# EasyEDA Pro project 平衡车.eprj

# Schematic STM32平衡车
Board Name: STM32平衡车; Create Date: 2024-11-28; Page Name: Sheet_1; Project Name: 平衡车; Schematic Name: STM32平衡车; Update Date: 2025-01-06; Add into BOM: yes; Company: Your Company; Convert to PCB: yes; Date: 2021-10-18; Draw By: 张建宝; REV: 1.0; Sheet: 1/1
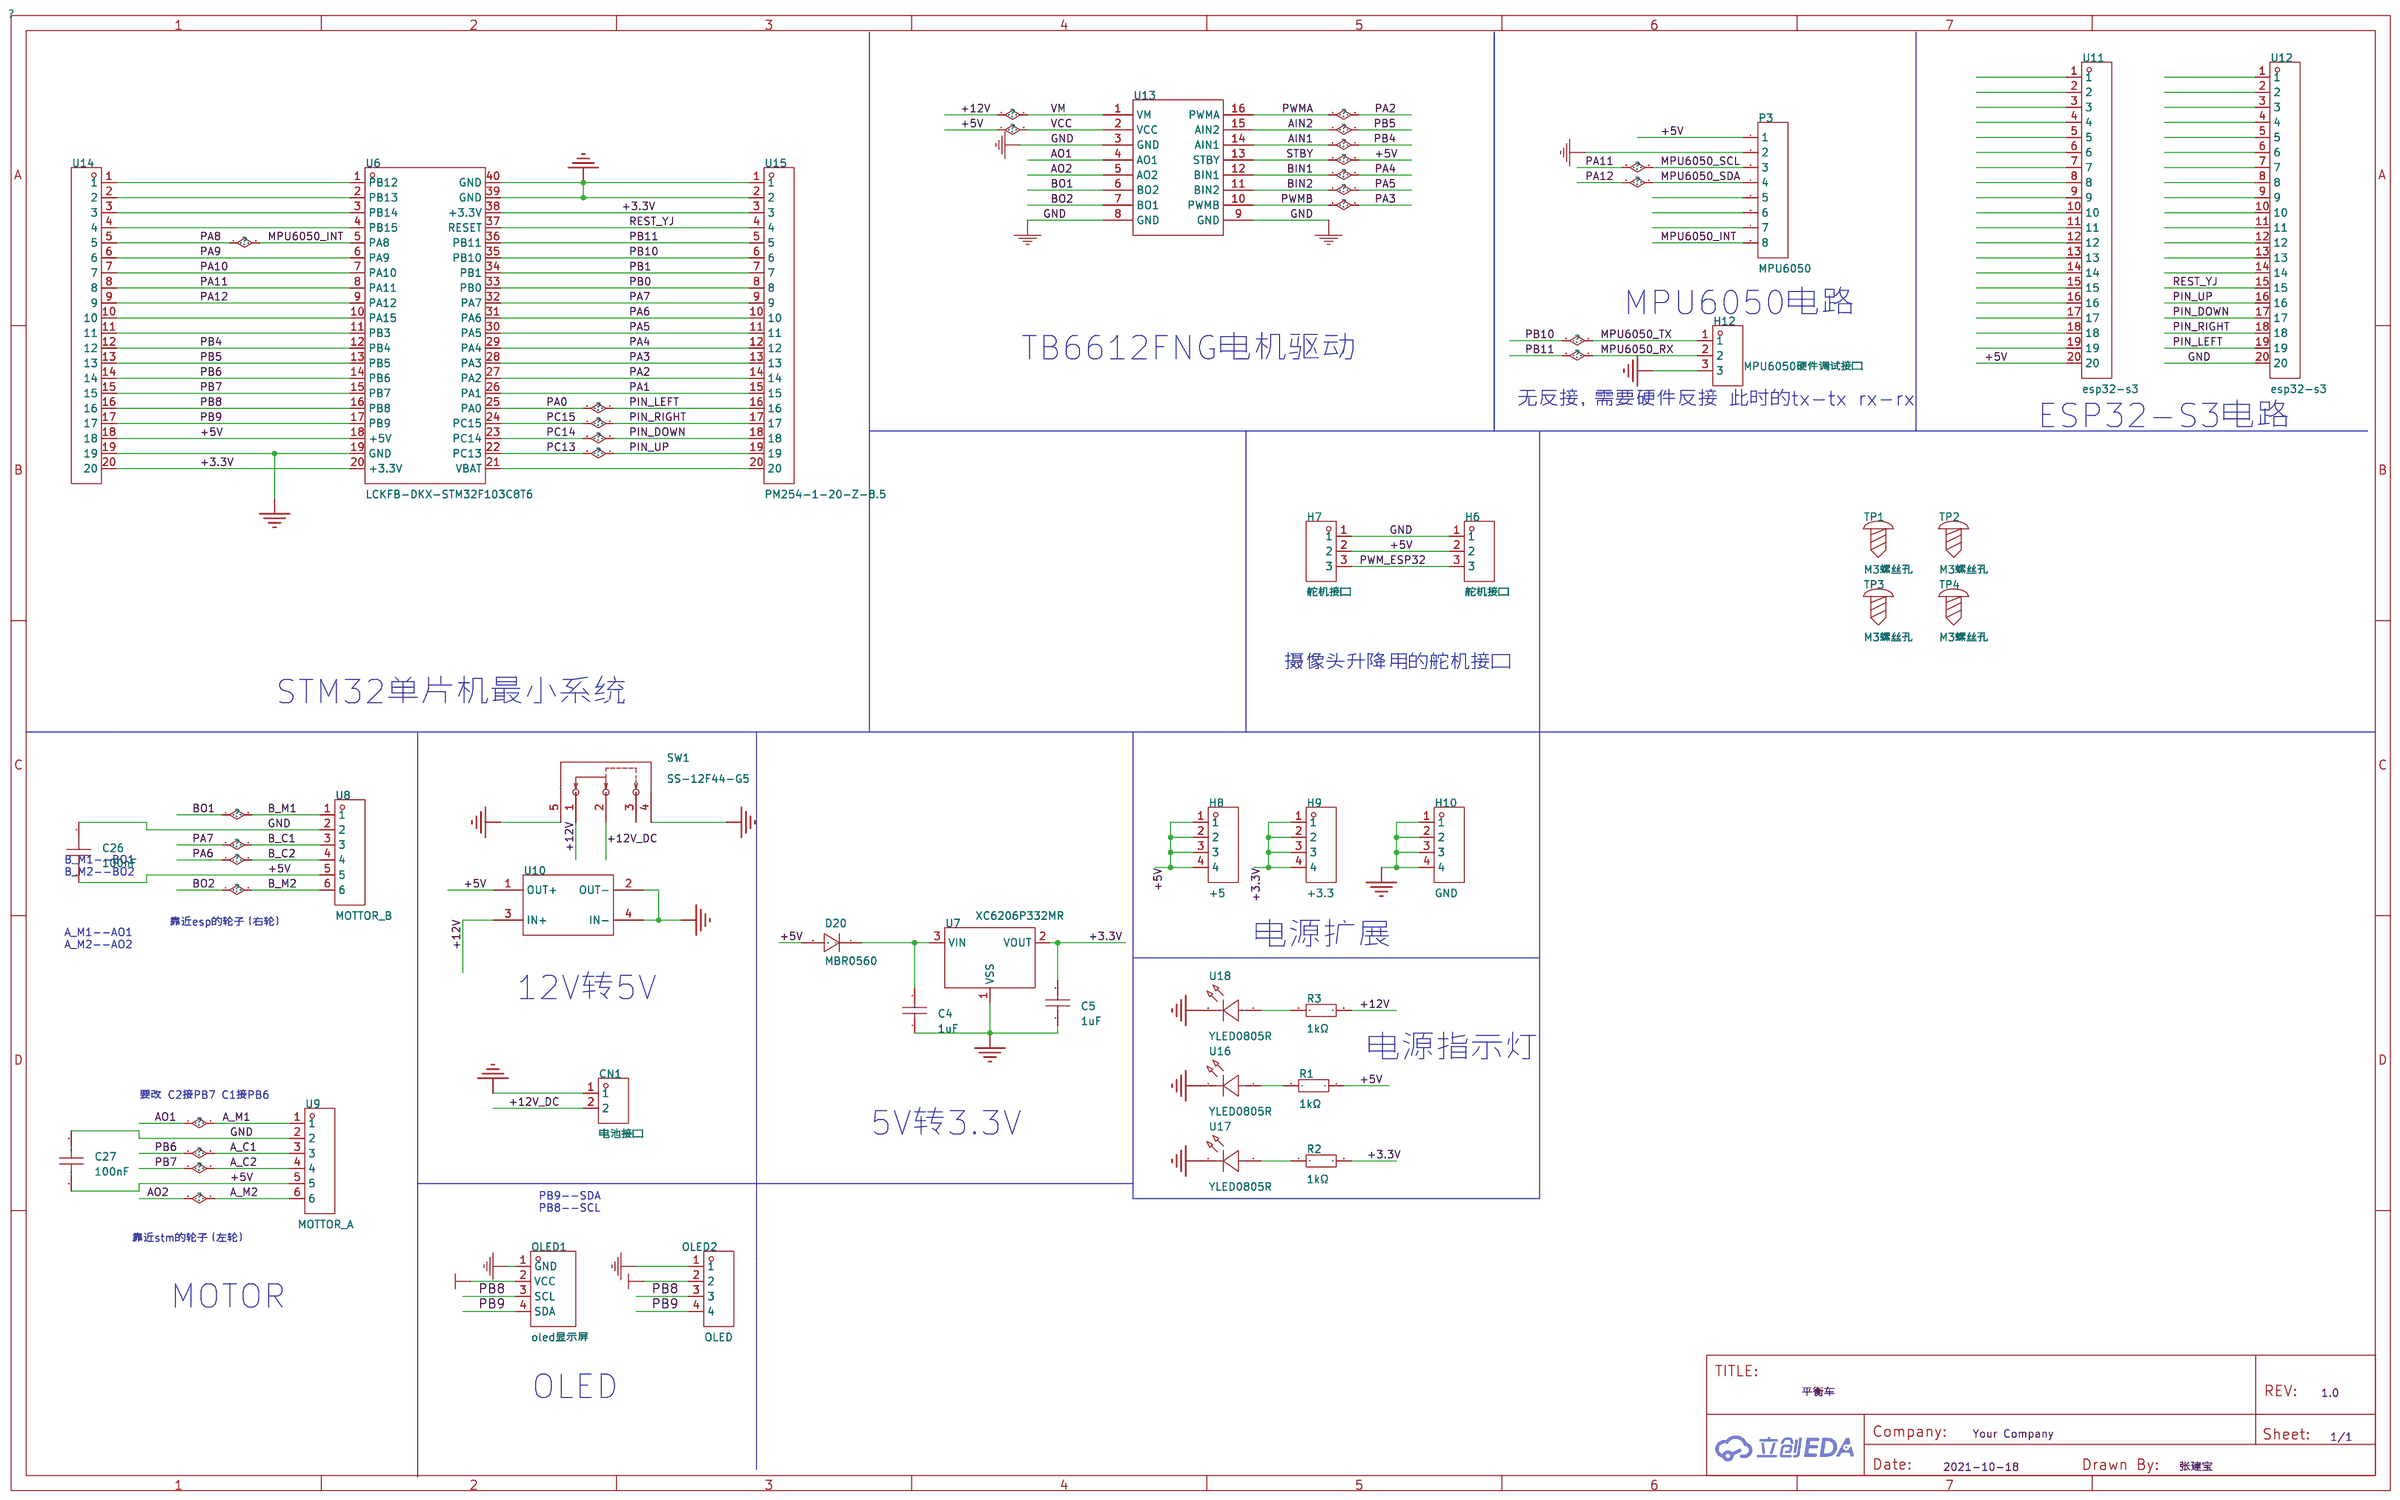
[diagram p0: schematic sheet]

## Parts
C4  1uF  [C0805]
C5  1uF  [C0805]
C26  100nF  [C0805]
C27  100nF  [C0805]
CN1  电池接口  [CONN-TH_2P-P2.50_HX25003-2A]
D20  MBR0560  [SOD-123_L2.8-W1.8-LS3.7-RD]
H6  舵机接口  [HDR-TH_3P-P2.54-V-M]
H7  舵机接口  [HDR-TH_3P-P2.54-V-M]
H8  +5  [HDR-TH_4P-P2.54-V-M]
H9  +3.3  [HDR-TH_4P-P2.54-V-M]
H10  GND  [HDR-TH_4P-P2.54-V-M]
H12  MPU6050硬件调试接口  [HDR-TH_3P-P2.54-V-M]
OLED1  oled显示屏  [OLED-TH_L35.4-W33.5_HS13L03W2C01]
OLED2  OLED  [HDR-TH_4P-P2.54-V-M]
P3  MPU6050  [HDR-TH_8P-P2.54-V-F-1]
R1  1kΩ  [R0805]
R2  1kΩ  [R0805]
R3  1kΩ  [R0805]
SW1  SS-12F44-G5  [SW-TH_SS-12F44-G5]
TP1  M3螺丝孔  [M3螺丝]
TP2  M3螺丝孔  [M3螺丝]
TP3  M3螺丝孔  [M3螺丝]
TP4  M3螺丝孔  [M3螺丝]
U6  LCKFB-DKX-STM32F103C8T6  [CONN-TH_L53.3-W22.9_STM32F103C8T6-CARD]
U7  XC6206P332MR  [SOT-23-3_L2.9-W1.3-P1.90-LS2.4-BR]
U8  MOTTOR_B  [CONN-TH_6P-P2.50_ZX-XH2.54-6PZZ]
U9  MOTTOR_A  [CONN-TH_6P-P2.50_ZX-XH2.54-6PZZ]
U10  -  [DC-DC]
U11  esp32-s3  [HDR-TH_20P-P2.54-V-F-2]
U12  esp32-s3  [HDR-TH_20P-P2.54-V-F-2]
U13  -  [TB6612FNG模块]
U14  PM254-1-20-Z-8.5  [HDR-TH_20P-P2.54-V-F-2]
U15  PM254-1-20-Z-8.5  [HDR-TH_20P-P2.54-V-F-2]
U16  YLED0805R  [LED0805-RD]
U17  YLED0805R  [LED0805-RD]
U18  YLED0805R  [LED0805-RD]

## Library data of the parts
C4 C5 = CL21B105KBFNNNE: 容值:1uF;精度:±10%;额定电压:50V;材质(温度系数):X7R;; LCSC Part Name: 1uF ±10% 50V; Supplier Part: C28323; Manufacturer: SAMSUNG(三星); Supplier Footprint: 0805; JLCPCB Part Class: 基础库; Datasheet: https://atta.szlcsc.com/upload/public/pdf/source/20160103/1457707718219.pdf; Supplier: LCSC; Tolerance: ±10%; Voltage Rated: 50V; Temperature Coefficient: X7R
C26 C27 = CC0805KRX7R9BB104: LCSC Part Name: 100nF ±10% 50V; Supplier Part: C49678; Manufacturer: YAGEO(国巨); Supplier Footprint: 0805; JLCPCB Part Class: 基础库; Datasheet: https://atta.szlcsc.com/upload/public/pdf/source/20180224/C181747_15194369449651363981.pdf; Supplier: LCSC; Tolerance: ±10%; Voltage Rated: 50V; Temperature Coefficient: X7R
CN1 = ZX-XH2.54-2PZZ: Supplier Part: C7429632; Manufacturer: Megastar(兆星); Supplier Footprint: 插件,P=2.54mm; JLCPCB Part Class: 扩展库; Datasheet: https://atta.szlcsc.com/upload/public/pdf/source/20230619/19BA6947230AA44A04D3EDD65E618FD0.pdf; Supplier: LCSC; Pins Structure: 1x2P; Pitch: 2.54mm; Mounting Style: 直插; Reference Series: XH; Number of Pins: 2P; Number of Rows: 1; Number of PINs Per Row: 2; Current Rating (Max): 3A; Contact Material: 黄铜; Contact Plating: 锡; Operating Temperature Range: -25℃~+85℃
D20 = MBR0560: 直流反向耐压(Vr):60V;平均整流电流(Io):500mA;正向压降(Vf):700mV@500mA;; LCSC Part Name: 60V 500mA 700mV@500mA; Supplier Part: C77338; Manufacturer: CJ(江苏长电/长晶); Supplier Footprint: SOD-123; JLCPCB Part Class: 扩展库; Datasheet: https://atta.szlcsc.com/upload/public/pdf/source/20160702/1467448303403.pdf; Supplier: LCSC; Reverse Voltage (Vr): 60V; Average Rectified Current (Io): 500mA; Forward Voltage (Vf@If): 700mV@500mA
H6 H7 H12 = PZ254V-11-03P: LCSC Part Name: 间距:2.54mm 1x3P 直插 方针; Supplier Part: C2937625; Manufacturer: XFCN(兴飞); Supplier Footprint: 插件,P=2.54mm; JLCPCB Part Class: 扩展库; Datasheet: https://atta.szlcsc.com/upload/public/pdf/source/20200309/C492402_8335C3D49C4E4C618838D59BB1D024C1.pdf; Supplier: LCSC; Pin Structure: 1x3P; Pitch: 2.54mm; Circluar Pins/Square Pins: 方针; Mounting Type: 直插; Number of Rows: 单排; Number of Pins: 3P; Current Rating (Max): 3A; Voltage Rating (Max): 250V; Length of Mating Pin: 6mm; Insulation Height: 2.5mm; Length of End Connection Pin: 3mm; Operating Temperature Range: -40℃~+105℃; Color: 黑色
H8-H10 OLED2 = PZ254V-11-04P: LCSC Part Name: 间距:2.54mm 1x4P 直插 方针; Supplier Part: C2691448; Manufacturer: XFCN(兴飞); Supplier Footprint: 插件,P=2.54mm; JLCPCB Part Class: 扩展库; Datasheet: https://atta.szlcsc.com/upload/public/pdf/source/20200309/C492403_F9F19131791D08044AD4F84F8E751A34.pdf; Supplier: LCSC; Pin Structure: 1x4P; Pitch: 2.54mm; Circluar Pins/Square Pins: 方针; Mounting Type: 直插; Number of Rows: 单排; Number of Pins: 4P; Current Rating (Max): 3A; Voltage Rating (Max): 250V; Length of Mating Pin: 6mm; Insulation Height: 2.5mm; Length of End Connection Pin: 3mm; Operating Temperature Range: -40℃~+105℃; Color: 黑色
OLED1 = HS13L03W2C01: LCSC Part Name: 1.3'1.3寸 128*64 OLED显示屏 I2C通讯 SH1106 白光; Supplier Part: C7465997; Manufacturer: HS(汉昇); JLCPCB Part Class: 扩展库; Datasheet: https://atta.szlcsc.com/upload/public/pdf/source/20230720/8731A47396DED074CDCD72E9ACEFB46F.pdf; Supplier: LCSC; Main Control Chip: SH1106; Interface Type: I2C; Size: 1.3; Operating Temperature: -40℃~+70℃
P3 = 2.54-1*8P母环保: LCSC Part Name: 间距:2.54mm 1x8P 直插; Supplier Part: C27438; Manufacturer: BOOMELE(博穆精密); Supplier Footprint: 插件,P=2.54mm; JLCPCB Part Class: 扩展库; Datasheet: https://atta.szlcsc.com/upload/public/pdf/source/20231221/1CA800C6799ED97958773716FAA1BFFE.pdf; Supplier: LCSC; Holes Structure: 1x8P; Pitch: 2.54mm; Mounting Type: 直插; Number of Rows: 单排; Number of Holes: 8P
R1-R3 = 0805W8F1002T5E_C17414: LCSC Part Name: 10kΩ ±1% 125mW 厚膜电阻; Supplier Part: C17414; Manufacturer: UNI-ROYAL(厚声); Manufacturer Part: 0805W8F1002T5E; Supplier Footprint: 0805; JLCPCB Part Class: 基础库; Datasheet: https://atta.szlcsc.com/upload/public/pdf/source/20200306/C422600_1E6D84923E4A46A82E41ADD87F860B5C.pdf; Supplier: LCSC; Type: 厚膜电阻; Tolerance: ±1%; Power(Watts): 125mW; Overload Voltage (Max): 150V; Temperature Coefficient: ±100ppm/℃; Operating Temperature Range: -55℃~+155℃
SW1 = SS-12F44-G5_C136718: LCSC Part Name: 直插双档 滑动开关; Supplier Part: C136718; Manufacturer: 韩国韩荣; Supplier Footprint: 插件; JLCPCB Part Class: 扩展库; Datasheet: https://atta.szlcsc.com/upload/public/pdf/source/20171123/C136718_15114108132111137440.pdf; Supplier: LCSC; Circuit: 单刀双掷; Actuator Style: 矩形柱状; Pin Style: PC引脚; Switch Height: 11mm; Mounting Style: 直插; Mechanical Life: 5千次; Operating Temperature: -25℃~+70℃
TP1-TP4 = M3螺丝孔
U6 = LCKFB-DKX-STM32F103C8T6: LCSC Part Name: 立创·地阔星-STM32F103C8T6开发板; Supplier Part: C22396880; Manufacturer: 立创开发板; JLCPCB Part Class: 扩展库; Datasheet: https://atta.szlcsc.com/upload/public/pdf/source/20240801/7EEF69F7480DF7C6DA98696664D658D4.pdf; Supplier: LCSC
U7 = XC6206P332MR_C5148692: 输出类型:固定;输出极性:正;最大输入电压:8V;输出电压:3.3V;输出电流:300mA;; LCSC Part Name: 输入8V 输出3.3V 300mA; Supplier Part: C5148692; Manufacturer: HXY MOSFET(华轩阳电子); Supplier Footprint: SOT-23(TO-236); JLCPCB Part Class: 扩展库; Datasheet: https://atta.szlcsc.com/upload/public/pdf/source/20230315/7D5B35EFFBBF81C2EFC36318D2A1A670.pdf; Supplier: LCSC; Output Type: 固定; Output Polarity: 正; Number of Outputs: 1; Maximum Input Voltage: 8V; Output Voltage: 3.3V; Dropout Voltage: 240mV@(50mA); Output Current: 300mA
U8 U9 = ZX-XH2.54-6PZZ: LCSC Part Name: 配套胶壳型号：ZX-XH2.54-6PJK 配套端子型号：ZX-XH2.54-DZ 配套杜邦线型号：ZX-XH2.54-6PBXC; Supplier Part: C7429636; Manufacturer: Megastar(兆星); Supplier Footprint: 插件,P=2.54mm; JLCPCB Part Class: 扩展库; Datasheet: https://atta.szlcsc.com/upload/public/pdf/source/20230619/1243AD0A516E39CD3D274D8985780568.pdf; Supplier: LCSC; Pins Structure: 1x6P; Pitch: 2.54mm; Mounting Style: 直插; Reference Series: XH; Number of Pins: 6P; Number of Rows: 1; Number of PINs Per Row: 6; Current Rating (Max): 3A; Contact Material: 黄铜; Contact Plating: 锡; Operating Temperature Range: -25℃~+85℃
U10 = dc-dc升压模块
U11 U12 U14 U15 = PM254-1-20-Z-8.5: LCSC Part Name: 1x20P 间距:2.54mm 直插; Supplier Part: C2897383; Manufacturer: HCTL(华灿天禄); Supplier Footprint: 插件,P=2.54mm; JLCPCB Part Class: 扩展库; Datasheet: https://atta.szlcsc.com/upload/public/pdf/source/20230609/534BE42964C679BDE98E061007C4ABD6.pdf; Supplier: LCSC; Holes Structure: 1x20P; Pitch: 2.54mm; Circular Hole / Square Hole: 方孔; Mounting Type: 直插; Number of Rows: 单排; Number of Holes: 20P; Current Rating (Max): 3A; Holes Direction: 顶部; Insulation Height: 8.5mm; Contact Material: 铜合金; Operating Temperature Range: -40℃~+105℃; Soldering Temperature(Max): 260℃@5S
U13 = TB6612FNG模块
U16-U18 = YLED0805R: Supplier Part: C19171391; Manufacturer: YONGYUTAI(永裕泰); Supplier Footprint: 0805; JLCPCB Part Class: 扩展库; Datasheet: https://atta.szlcsc.com/upload/public/pdf/source/20231027/AB486D22E6D71BC59190C48A798367E6.pdf; Supplier: LCSC; Emitted Color: 红色; Forward Voltage (VF): 1.8V~2.4V; Power Dissipation: 60mW; Forward Current: 20mA; Dominant Wavelength: 615nm~630nm; Peak Wavelength: 645nm; Operating Temperature: -40℃~+85℃

## Nets
+3.3V: C5.2 H9.1 H9.2 H9.3 H9.4 R2.2 U6.20(+3.3V) U6.38(+3.3V) U7.2(VOUT) U14.20 U15.3
+5V: C26.1 C27.1 D20.2 H6.2 H7.2 H8.1 H8.2 H8.3 H8.4 OLED1.2(VCC) OLED2.2 P3.1 R1.2 U6.18(+5V) U8.5 U9.5 U10.1(OUT+) U11.20 U13.2(VCC) U13.13(STBY) U14.18
+12V: R3.2 SW1.1 U10.3(IN+) U13.1(VM)
+12V_DC: CN1.2 SW1.2
GND: C4.1 C5.1 C26.2 C27.2 CN1.1 H6.1 H7.1 H10.1 H10.2 H10.3 H10.4 H12.3 OLED1.1(GND) OLED2.1 P3.2 SW1.4 SW1.5 U6.19(GND) U6.39(GND) U6.40(GND) U7.1(VSS) U8.2 U9.2 U10.2(OUT-) U10.4(IN-) U12.20 U13.3(GND) U13.8(GND) U13.9(GND) U14.19 U15.1 U15.2 U16.1(K) U17.1(K) U18.1(K)
A_C1: U6.14(PB6) U9.3 U14.14
A_C2: U6.15(PB7) U9.4 U14.15
AIN1: U6.12(PB4) U13.14(AIN1) U14.12
AIN2: U6.13(PB5) U13.15(AIN2) U14.13
AO1: U9.1 U13.4(AO1)
AO2: U9.6 U13.5(AO2)
B_C1: U6.32(PA7) U8.3 U15.9
B_C2: U6.31(PA6) U8.4 U15.10
BIN1: U6.29(PA4) U13.12(BIN1) U15.12
BIN2: U6.30(PA5) U13.11(BIN2) U15.11
BO1: U8.1 U13.6(BO2)
BO2: U8.6 U13.7(BO1)
MPU6050_INT: P3.8 U6.5(PA8) U14.5
MPU6050_RX: H12.2 U6.36(PB11) U15.5
MPU6050_SCL: P3.3 U6.8(PA11) U14.8
MPU6050_SDA: P3.4 U6.9(PA12) U14.9
MPU6050_TX: H12.1 U6.35(PB10) U15.6
PA0: U6.25(PA0) U12.19 U15.16
PA1: U6.26(PA1) U15.15
PA2: U6.27(PA2) U13.16(PWMA) U15.14
PA3: U6.28(PA3) U13.10(PWMB) U15.13
PA9: U6.6(PA9) U14.6
PA10: U6.7(PA10) U14.7
PB0: U6.33(PB0) U15.8
PB1: U6.34(PB1) U15.7
PB8: OLED1.3(SCL) OLED2.3 U6.16(PB8) U14.16
PB9: OLED1.4(SDA) OLED2.4 U6.17(PB9) U14.17
PC13: U6.22(PC13) U12.16 U15.19
PC14: U6.23(PC14) U12.17 U15.18
PC15: U6.24(PC15) U12.18 U15.17
PWM_ESP32: H6.3 H7.3
REST_YJ: U6.37(RESET) U12.15 U15.4
$1N4351: C4.2 D20.1 U7.3(VIN)
$1N5150: U6.1(PB12) U14.1
$1N5156: U6.2(PB13) U14.2
$1N5158: U6.3(PB14) U14.3
$1N5160: U6.4(PB15) U14.4
$1N5210: U6.11(PB3) U14.11
$1N5216: U6.10(PA15) U14.10
$1N5238: U6.21(VBAT) U15.20
$1N12997: R1.1 U16.2(A)
$1N12999: R2.1 U17.2(A)
$1N13001: R3.1 U18.2(A)

Not connected (* = marked no-connect by the designer): P3 5 6 7; SW1 3; U11 1 2 3 4 5 6 7 8 9 10 11 12 13 14 15 16 17 18 19; U12 1 2 3 4 5 6 7 8 9 10 11 12 13 14

## Notes on the sheet
- MPU6050电路
- TB6612FNG电机驱动
- 无反接，需要硬件反接 此时的tx-tx rx-rx
- ESP32-S3电路
- 摄像头升降用的舵机接口
- STM32单片机最小系统
- 靠近esp的轮子（右轮）
- B_M1--BO1
  B_M2--BO2
  A_M1--AO1
  A_M2--AO2
- 电源扩展
- 12V转5V
- 电源指示灯
- 要改 C2接PB7 C1接PB6
- 5V转3.3V
- PB9--SDA
  PB8--SCL
- 靠近stm的轮子（左轮）
- MOTOR
- OLED

# Board PCB1
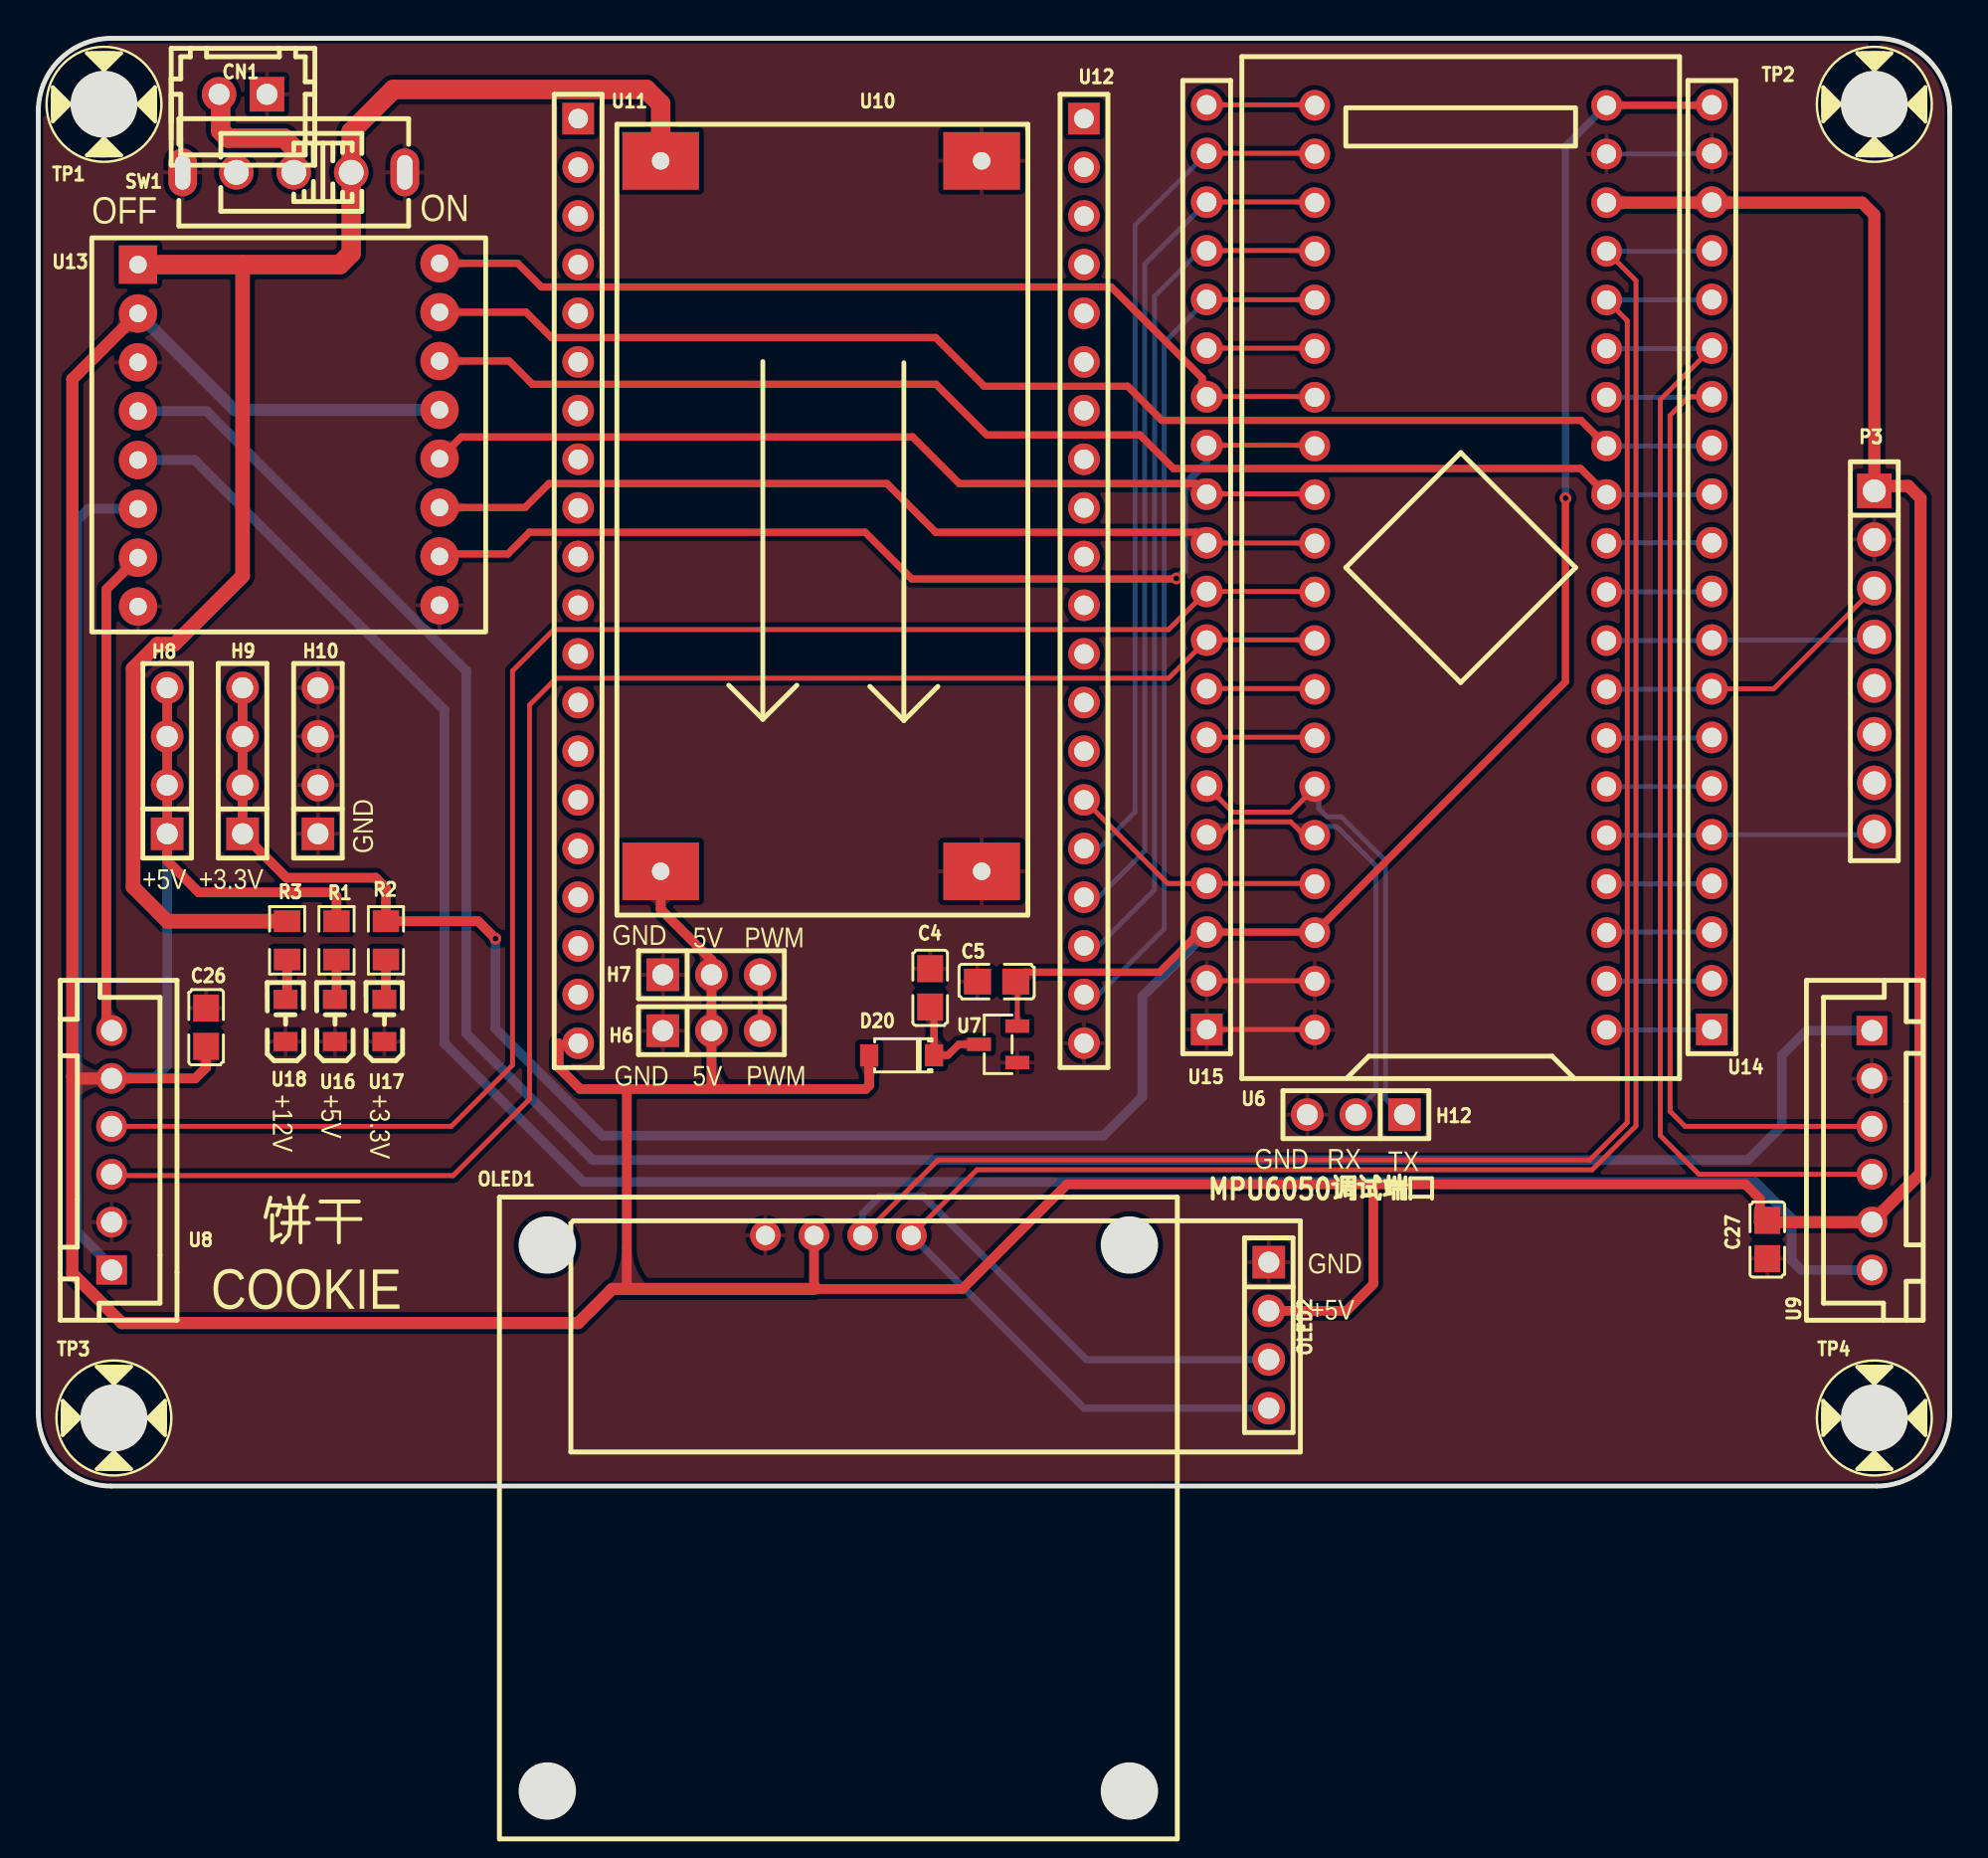
[diagram p1: board, top side]
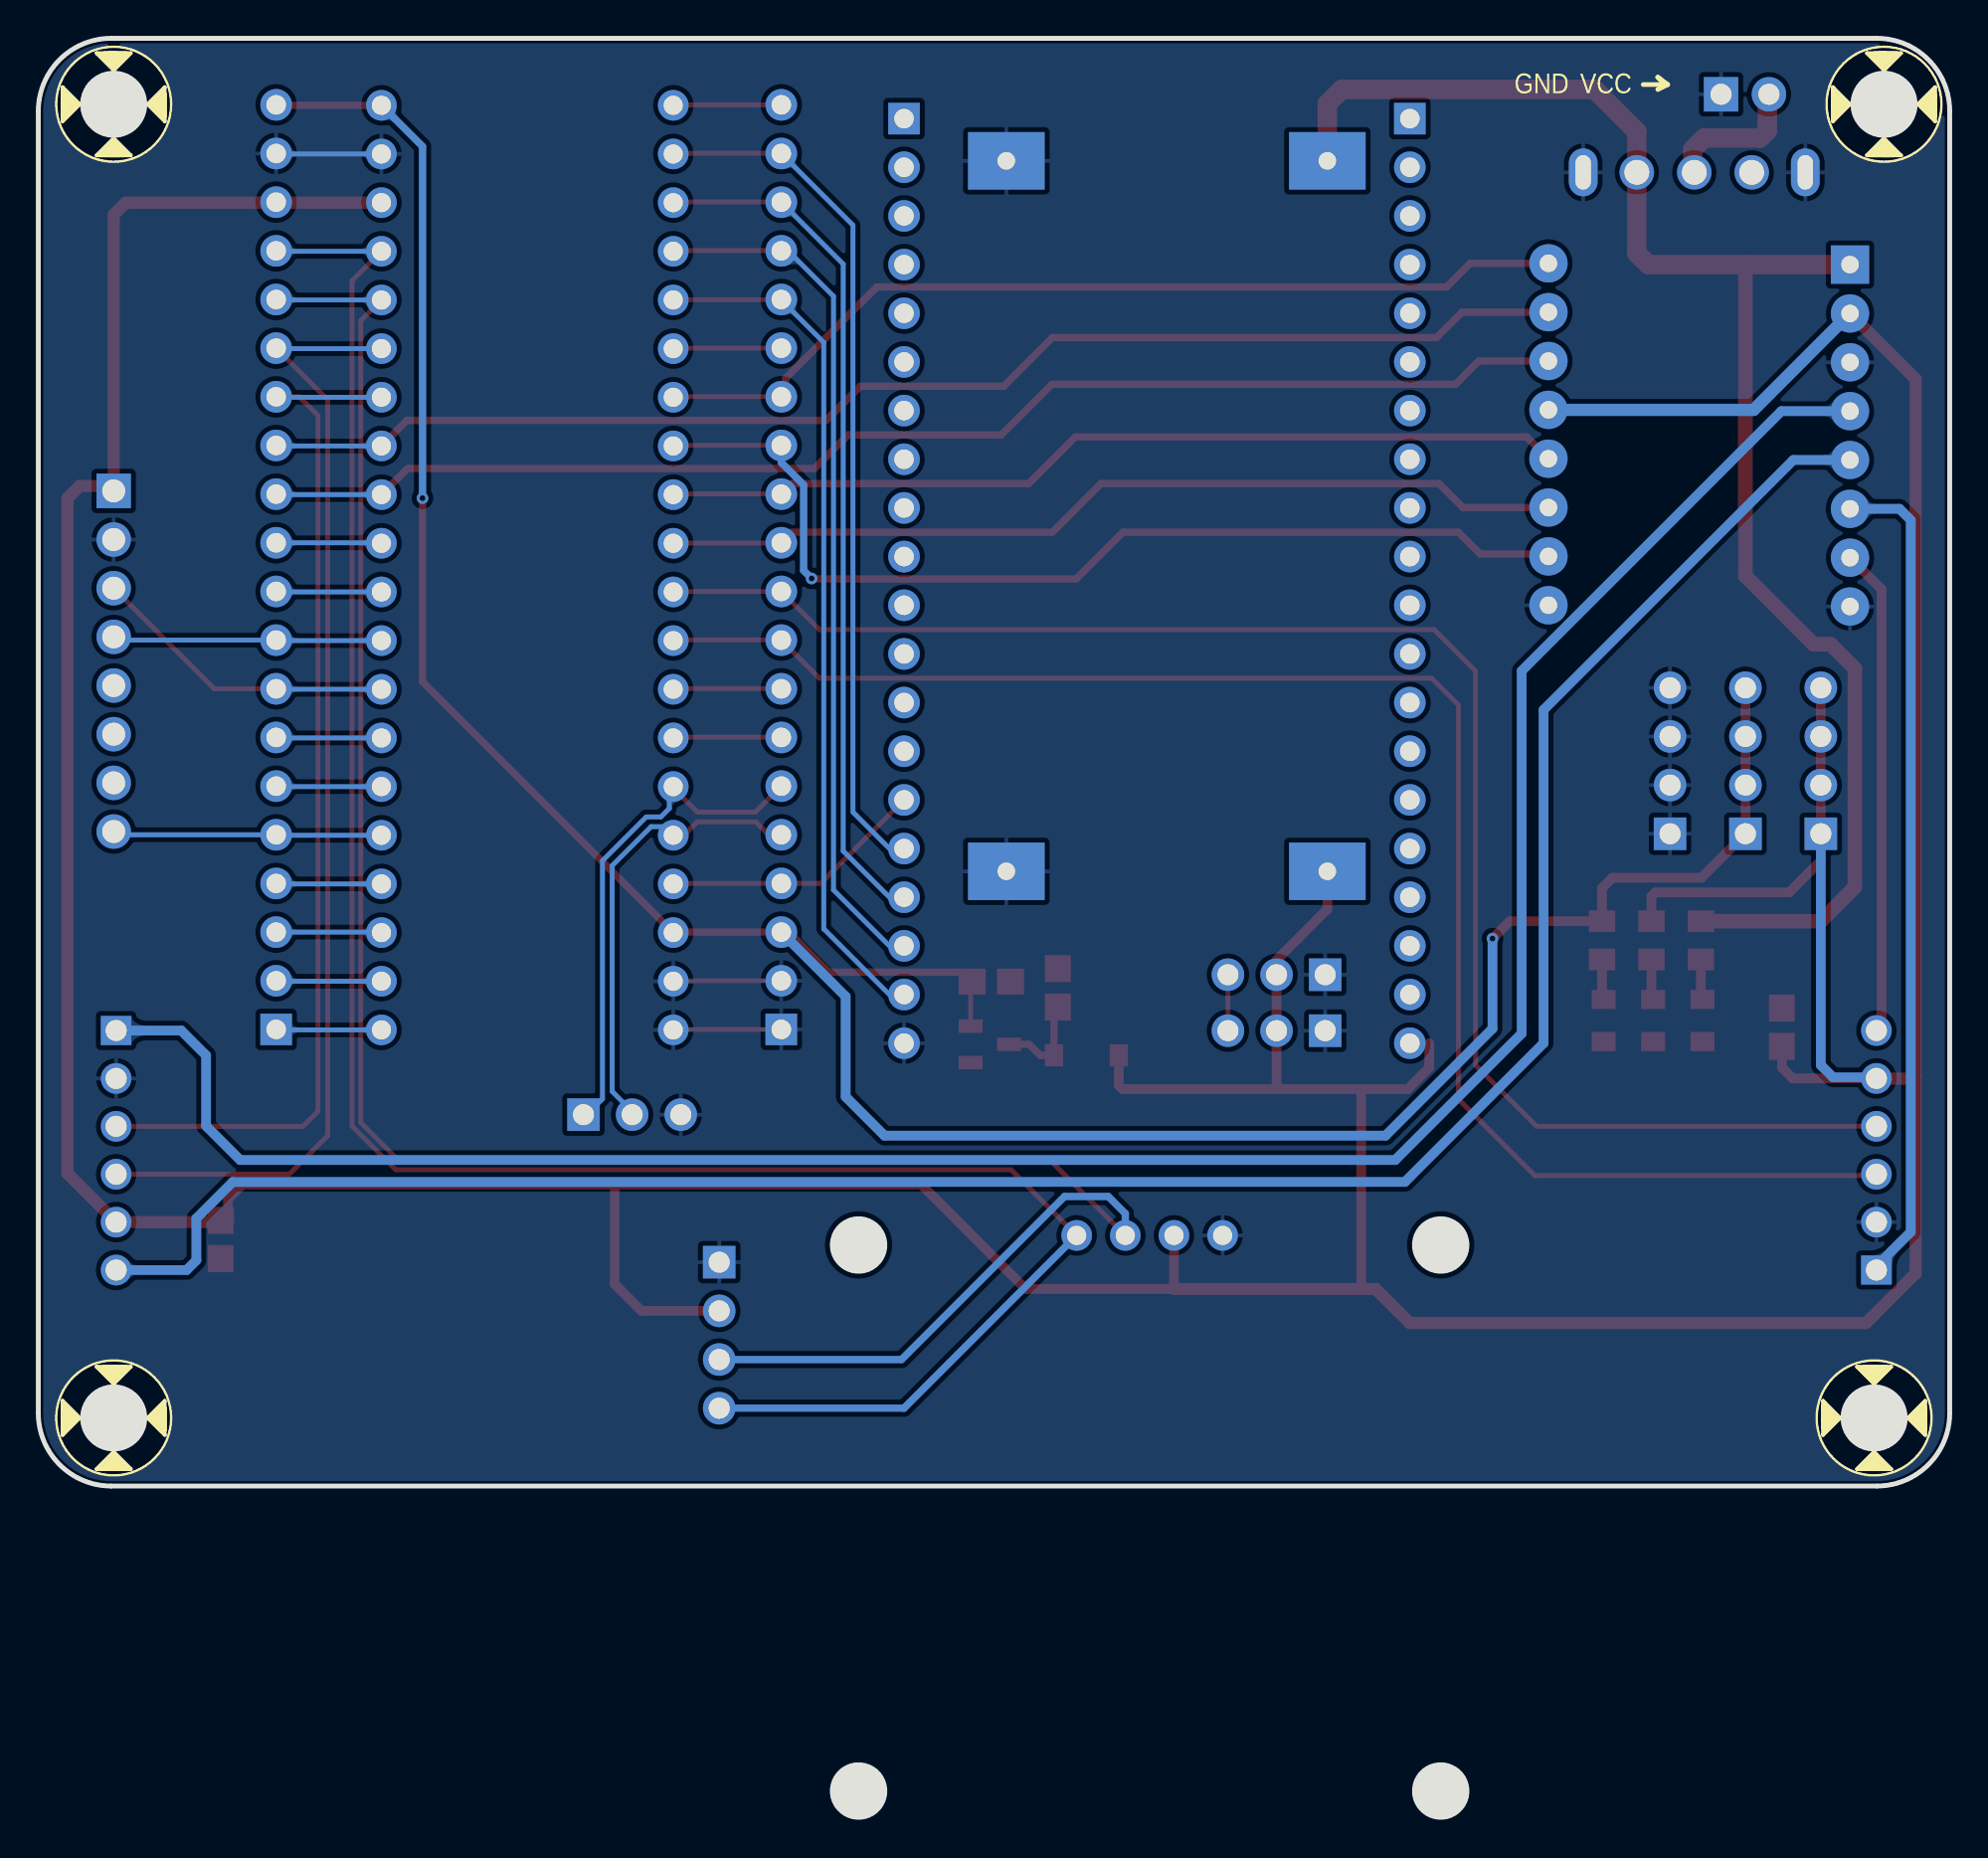
[diagram p2: board, bottom side, seen from below]

Outline 99.82 x 92.98 mm; copper layers: Top Layer, Bottom Layer. Coordinates in mm from the lower left corner of the outline.
Outline path: 0,89.17 0,21.22 arc(1.12,18.53) 3.81,17.41 96.01,17.41 arc(98.71,18.53) 99.82,21.22 99.82,89.17 arc(98.71,91.86) 96.01,92.98 3.81,92.98 arc(1.12,91.86) 0,89.17
Stack: Top Layer 0.035mm / Dielectric1 1.51mm FR4 er 4.5 / Bottom Layer 0.035mm

## Design rules (mm)
template: JLCPCB Capability(Two Layers Board)
spacing copperThickness1oz (default): track to track 0.102, other pairs 0.152 to 0.3
spacing copperThickness2oz: track to track 0.203, other pairs 0.152 to 0.3
track width copperThickness1oz (default): min 0.127, default 0.254, max 2.54
track width copperThickness2oz: min 0.203, default 0.254, max 2.54
differential pair differentialPair (default): width min 0.127, default 0.254, max 2.54; gap min 0.152, default 0.152
via viaSize (default): diameter min 0.5, default 0.61, max 10; hole min 0.3, default 0.305, max 6.3

## Placement (name value [footprint] x y rotation side)
C4  1uF  [C0805]  46.58 43.42 270 top
C5  1uF  [C0805]  50.05 43.74 0 top
C26  100nF  [C0805]  8.76 41.36 90 top
C27  100nF  [C0805]  90.3 30.28 270 top
CN1  电池接口  [CONN-TH_2P-P2.50_HX25003-2A]  10.69 90.06 0 top
D20  MBR0560  [SOD-123_L2.8-W1.8-LS3.7-RD]  45.08 39.9 180 top
H6  舵机接口  [HDR-TH_3P-P2.54-V-M]  35.15 41.18 0 top
H7  舵机接口  [HDR-TH_3P-P2.54-V-M]  35.15 44.1 0 top
H8  +5  [HDR-TH_4P-P2.54-V-M]  6.73 55.27 90 top
H9  +3.3  [HDR-TH_4P-P2.54-V-M]  10.67 55.27 90 top
H10  GND  [HDR-TH_4P-P2.54-V-M]  14.61 55.27 90 top
H12  MPU6050硬件调试接口  [HDR-TH_3P-P2.54-V-M]  68.81 36.8 180 top
OLED1  oled显示屏  [OLED-TH_L35.4-W33.5_HS13L03W2C01]  41.78 30.5 0 top
OLED2  OLED  [HDR-TH_4P-P2.54-V-M]  64.26 25.29 270 top
P3  MPU6050  [HDR-TH_8P-P2.54-V-F-1]  95.89 60.47 270 top
R1  1kΩ  [R0805]  15.58 45.9 90 top
R2  1kΩ  [R0805]  18.16 45.9 90 top
R3  1kΩ  [R0805]  12.99 45.9 90 top
SW1  SS-12F44-G5  [SW-TH_SS-12F44-G5]  13.34 85.98 180 top
TP1  M3螺丝孔  [M3螺丝]  3.43 89.54 0 top
TP2  M3螺丝孔  [M3螺丝]  95.89 89.54 0 top
TP3  M3螺丝孔  [M3螺丝]  3.95 20.97 0 top
TP4  M3螺丝孔  [M3螺丝]  95.89 20.97 0 top
U6  LCKFB-DKX-STM32F103C8T6  [CONN-TH_L53.3-W22.9_STM32F103C8T6-CARD]  74.28 65.35 90 top
U7  XC6206P332MR  [SOT-23-3_L2.9-W1.3-P1.90-LS2.4-BR]  50.13 40.47 0 top
U8  MOTTOR_B  [CONN-TH_6P-P2.50_ZX-XH2.54-6PZZ]  3.83 34.94 270 top
U9  MOTTOR_A  [CONN-TH_6P-P2.50_ZX-XH2.54-6PZZ]  95.76 34.94 90 top
U10  -  [DC-DC]  41.47 67.28 180 top
U11  esp32-s3  [HDR-TH_20P-P2.54-V-F-2]  28.19 64.66 270 top
U12  esp32-s3  [HDR-TH_20P-P2.54-V-F-2]  54.61 64.66 270 top
U13  -  [TB6612FNG模块]  13.08 72.28 0 top
U14  PM254-1-20-Z-8.5  [HDR-TH_20P-P2.54-V-F-2]  87.4 65.38 90 top
U15  PM254-1-20-Z-8.5  [HDR-TH_20P-P2.54-V-F-2]  61.02 65.38 90 top
U16  YLED0805R  [LED0805-RD]  15.49 41.71 90 top
U17  YLED0805R  [LED0805-RD]  18.07 41.71 90 top
U18  YLED0805R  [LED0805-RD]  12.91 41.71 90 top

## Footprints (pads in the part's own frame, mm; a bottom-side part is the same pattern mirrored in y, then rotated)
C0805
  rect 1.41x1.35 smd: 1(-1,0) 2(1,0)
CONN-TH_2P-P2.50_HX25003-2A
  rect 1.8x1.8 hole 1.1: 1(1.25,0)
  round 1.8 hole 1.1: 2(-1.25,0)
CONN-TH_6P-P2.50_ZX-XH2.54-6PZZ
  rect 1.524x1.6 hole 1.1: 1(6.25,0)
  round 1.6 hole 1.1: 2(3.75,0) 3(1.25,0) 4(-1.25,0) 5(-3.75,0) 6(-6.25,0)
CONN-TH_L53.3-W22.9_STM32F103C8T6-CARD
  round 1.6 hole 1: 1(-24.13,-7.62) 2(-21.59,-7.62) 3(-19.05,-7.62) 4(-16.51,-7.62) 5(-13.97,-7.62) 6(-11.43,-7.62) 7(-8.89,-7.62) 8(-6.35,-7.62) 9(-3.81,-7.62) 10(-1.27,-7.62) 11(1.27,-7.62) 12(3.81,-7.62) 13(6.35,-7.62) 14(8.89,-7.62) 15(11.43,-7.62) 16(13.97,-7.62) 17(16.51,-7.62) 18(19.05,-7.62) 19(21.59,-7.62) 20(24.13,-7.62) 21(24.13,7.62) 22(21.59,7.62) 23(19.05,7.62) 24(16.51,7.62) 25(13.97,7.62) 26(11.43,7.62) 27(8.89,7.62) 28(6.35,7.62) 29(3.81,7.62) 30(1.27,7.62) 31(-1.27,7.62) 32(-3.81,7.62) 33(-6.35,7.62) 34(-8.89,7.62) 35(-11.43,7.62) 36(-13.97,7.62) 37(-16.51,7.62) 38(-19.05,7.62) 39(-21.59,7.62) 40(-24.13,7.62)
DC-DC
  rect 4x3 hole 0.914: 1(8.964,17.782) 2(-7.8,17.782) 3(8.964,-19.302) 4(-7.8,-19.302)
HDR-TH_3P-P2.54-V-M
  rect 1.7x1.7 hole 1.1: 1(-2.54,0)
  round 1.7 hole 1.1: 2(0,0) 3(2.54,0)
HDR-TH_4P-P2.54-V-M
  rect 1.7x1.7 hole 1.1: 1(-3.81,0)
  round 1.7 hole 1.1: 2(-1.27,0) 3(1.27,0) 4(3.81,0)
HDR-TH_8P-P2.54-V-F-1
  rect 1.8x1.8 hole 1.2: 1(-8.89,0)
  round 1.8 hole 1.2: 2(-6.35,0) 3(-3.81,0) 4(-1.27,0) 5(1.27,0) 6(3.81,0) 7(6.35,0) 8(8.89,0)
HDR-TH_20P-P2.54-V-F-2
  rect 1.65x1.65 hole 1.02: 1(-24.13,0)
  round 1.65 hole 1.02: 2(-21.59,0) 3(-19.05,0) 4(-16.51,0) 5(-13.97,0) 6(-11.43,0) 7(-8.89,0) 8(-6.35,0) 9(-3.81,0) 10(-1.27,0) 11(1.27,0) 12(3.81,0) 13(6.35,0) 14(8.89,0) 15(11.43,0) 16(13.97,0) 17(16.51,0) 18(19.05,0) 19(21.59,0) 20(24.13,0)
LED0805-RD
  rect 1x1.25 smd: 1(-1.1,0) 2(1.1,0)
OLED-TH_L35.4-W33.5_HS13L03W2C01
  round 1.6 hole 1: 1(-3.81,0) 2(-1.27,0) 3(1.27,0) 4(3.81,0)
R0805
  rect 1.133x1.377 smd: 1(-1,0) 2(1,0)
SOD-123_L2.8-W1.8-LS3.7-RD
  rect 0.95x1.15 smd: 1(-1.692,0) 2(1.692,0)
SOT-23-3_L2.9-W1.3-P1.90-LS2.4-BR
  rect 1.25x0.7 smd: 1(1,-0.95) 2(1,0.95) 3(-1,0)
SW-TH_SS-12F44-G5
  round 1.8 hole 1.3: 1(-3,0) 2(0,0) 3(3,0)
  oval 1.5x2.5 hole 0.8x1.8: 4(5.8,0) 5(-5.8,0)
TB6612FNG模块
  rect 2x2 hole 0.914: 1(-7.874,8.89)
  round 2 hole 0.914: 2(-7.874,6.34) 3(-7.874,3.791) 4(-7.874,1.242) 5(-7.874,-1.308) 6(-7.874,-3.857) 7(-7.874,-6.407) 8(-7.874,-8.957) 9(7.874,-8.89) 10(7.874,-6.34) 11(7.874,-3.791) 12(7.874,-1.242) 13(7.874,1.308) 14(7.874,3.857) 15(7.874,6.407) 16(7.874,8.957)

## Nets
As in the schematic.

Pads without a net: SW1 3

## Via types
v1: diameter 0.61, hole 0.305, Top Layer to Bottom Layer, 3 vias

## Routing (per net, layer and track width the routed paths; a pad name or vN(x,y) marks a point on that pad's centre or on a via; arc(x,y) is an arc through that point)
+3.3V: length 149.8
  Top Layer w0.254: U7.2 51.13,43.66 C5.2
  Top Layer w0.381: U14.20 87.37,89.48 U6.20 ; C5.2 51.54,44.24 58.55,44.24 60.64,46.33 66.64,46.33 U6.38 79.76,59.4 v1(79.76,68.98)
  Top Layer w0.508: H9.4 H9.3 H9.2 H9.1 12.96,49.16 17.61,49.16 18.16,48.62 R2.2 22.97,46.9 v1(23.88,45.99)
  Bottom Layer w0.381: U6.20 79.76,87.34 v1(79.76,68.98)
  Bottom Layer w0.508: v1(23.88,45.99) 23.88,41.29 29.46,35.7 55.63,35.7 57.66,37.73 57.66,42.97 U15.3
+5V: length 340
  Top Layer w0.508: H8.4 H8.3 H8.2 H8.1 6.73,50.05 8.38,48.4 15.37,48.4 15.58,48.19 R1.2 ; 69.72,33.16 69.72,27.95 68.33,26.56 OLED2.2 ; 69.72,33.16 89.15,33.16 89.92,32.4 89.92,31.76 90.17,31.5 90.17,31.28 ; 69.72,33.16 53.72,33.16 48.26,27.7 40.72,27.7 40.51,27.91 ; C26.1 8.76,39.26 8.19,38.69 U8.5 ; 34.94,38.13 43.2,38.13 43.39,38.33 D20.2 ; 34.94,38.13 30.73,38.13 ; 34.94,38.13 35.15,38.35 H6.2 H7.2 35.15,44.87 32.5,47.52 U10.1 ; 30.73,38.13 30.73,27.7 ; 30.73,38.13 28.3,38.13 27.18,39.26 27.18,40.53 ; 40.51,27.91 40.51,27.7 ; 40.51,27.91 OLED1.2
  Top Layer w0.635: 95.89,69.61 97.66,69.61 98.3,68.98 98.3,33.73 U9.5 89.92,31.19 89.92,31.76 ; 95.89,69.61 95.89,83.77 95.25,84.4 87.37,84.4 ; 95.89,69.61 P3.1 ; U8.5 3.82,38.68 1.89,38.68 1.78,38.8 ; U14.18 87.37,84.4 ; 87.37,84.4 U6.18 ; 40.51,27.7 29.97,27.7 28.19,25.92 4.37,25.92 1.78,28.51 1.78,38.8 ; 1.78,38.8 1.78,75.19 5.21,78.62
  Bottom Layer w0.508: H8.1 6.73,39.39 6.1,38.75 3.89,38.75 U8.5
  Bottom Layer w0.635: 5.21,78.62 10.24,73.59 U13.13
+12V: length 82.3
  Top Layer w0.762: R3.2 6.73,46.9 4.95,48.67 4.95,60.09 6.22,61.36 7.11,61.36 10.67,64.91 10.67,81.17
  Top Layer w1.016: 5.21,81.17 15.75,81.17 16.34,81.76 SW1.1 16.34,88.11 18.54,90.31 31.75,90.31 32.5,89.56 U10.3
+12V_DC: length 7.5
  Top Layer w1.016: 13.42,85.91 13.42,87.18 12.83,87.77 9.91,87.77 9.53,88.15 9.53,89.97 9.44,90.06
GND: length 16.8
  Top Layer w0.254: U6.39 66.64,43.79 U15.2 ; U15.1 66.64,41.25 U6.40
  Bottom Layer w0.254: U14.19 87.37,86.94 U6.19
A_C1: length 55.3
  Top Layer w0.254: U14.14 86.19,74.27 85.22,73.29 85.22,36.97 86,36.19 U9.3
  Bottom Layer w0.254: U6.14 87.37,74.24 U14.14
A_C2: length 59.6
  Top Layer w0.254: U9.4 86.72,33.69 84.71,35.7 84.71,74.12 U14.15
  Bottom Layer w0.254: U6.15 87.37,76.78 U14.15
AIN1: length 69.3
  Top Layer w0.381: U6.12 80.54,70.53 59.28,70.53 57.53,72.28 49.53,72.28 46.89,74.92 25.81,74.92 24.59,76.14 U13.14
  Bottom Layer w0.254: U14.12 87.37,69.16 U6.12
AIN2: length 69.3
  Top Layer w0.381: U13.15 25.47,78.69 26.8,77.36 46.86,77.36 49.4,74.82 56.9,74.82 58.67,73.04 80.57,73.04 U6.13
  Bottom Layer w0.254: U14.13 87.37,71.7 U6.13
AO1: length 122.8
  Bottom Layer w0.508: 5.21,73.52 8.79,73.52 22.35,59.96 22.35,41.04 28.96,34.43 89.28,34.43 91.06,36.21 91.06,39.89 92.36,41.19 U9.1
AO2: length 119.5
  Bottom Layer w0.508: 5.21,70.97 8.17,70.97 21.21,57.93 21.21,40.53 28.45,33.29 89.66,33.29 91.57,31.38 91.57,29.2 92.08,28.69 U9.6
B_C1: length 86.5
  Top Layer w0.254: 66.69,61.56 66.66,61.58 61.04,61.58 ; U8.3 3.9,33.62 21.66,33.62 25.65,37.61 25.65,58.18 27.05,59.58 59.03,59.58 U15.9
B_C2: length 86.5
  Top Layer w0.254: U8.4 21.57,36.19 24.77,39.39 24.77,59.96 26.92,62.12 59.03,62.12 U15.10 66.64,64.11 U6.31
BIN1: length 47.4
  Top Layer w0.254: 61.04,69.2 66.66,69.2 66.69,69.18
  Top Layer w0.381: U13.12 22.09,72.18 45.66,72.18 48.1,69.74 60.47,69.74 U15.12
BIN2: length 47.5
  Top Layer w0.254: 66.69,66.61 66.66,66.64 61.04,66.64
  Top Layer w0.381: 20.95,68.49 25.42,68.49 26.67,69.74 44.32,69.74 46.86,67.2 60.47,67.2 U15.11
BO1: length 43.3
  Bottom Layer w0.508: 5.21,68.42 2.62,68.42 2.03,67.83 2.03,30.68 3.83,28.88 U8.1
BO2: length 25.5
  Top Layer w0.508: 5.21,65.87 3.56,64.22 3.56,41.46 U8.6
MPU6050_INT: length 14.1
  Bottom Layer w0.254: P3.8 95.72,51.41 U14.5 87.37,51.38 U6.5
MPU6050_RX: length 23.9
  Top Layer w0.254: U6.36 66.11,51.38 65.4,52.09 62.36,52.09 61.68,51.41 U15.5
  Bottom Layer w0.254: 68.64,36.8 69.85,38.01 69.85,49.8 67.82,51.83 67.11,51.83 U6.36
MPU6050_SCL: length 16.2
  Top Layer w0.254: U14.8 90.64,59.03 P3.3
  Bottom Layer w0.254: U14.8 87.37,59 U6.8
MPU6050_SDA: length 14.1
  Bottom Layer w0.254: U6.9 87.37,61.54 U14.9 95.72,61.57 P3.4
MPU6050_TX: length 26.6
  Top Layer w0.254: U15.6 62.37,52.59 65.4,52.59 66.55,53.74 66.85,53.74 U6.35 66.66,53.93
  Bottom Layer w0.254: U6.35 66.66,53.75 66.87,53.54 66.87,52.78 67.31,52.34 68.07,52.34 70.36,50.05 70.36,37.62 71.18,36.8
PA0: length 44.3
  Top Layer w0.254: 66.69,79.31 66.66,79.34 61.04,79.34
  Bottom Layer w0.254: 55.37,43.07 58.8,46.5 58.8,77.1 61.02,79.32 U15.16
PA1: length 5.7
  Top Layer w0.254: U15.15 66.64,76.81 U6.26
PA2: length 49.2
  Top Layer w0.254: 66.69,74.26 66.66,74.28 61.04,74.28
  Top Layer w0.381: U15.14 60.79,74.27 60.79,75.25 56.03,80 26.28,80 25.04,81.23 U13.16
PA3: length 53.3
  Top Layer w0.254: 61.04,71.74 66.66,71.74 66.69,71.72
  Top Layer w0.381: v1(59.44,64.79) 59.41,64.76 45.62,64.76 43.18,67.2 25.65,67.2 24.52,66.06 21.08,66.06 U13.10
  Bottom Layer w0.381: v1(59.44,64.79) 59.85,65.2 59.85,69.67 61.02,70.84 U15.13
PA9: length 5.5
  Bottom Layer w0.254: U6.6 87.37,53.92 U14.6
PA10: length 5.5
  Bottom Layer w0.254: U6.7 87.37,56.46 U14.7
PB0: length 5.7
  Top Layer w0.254: 66.69,59.02 66.66,59.04 61.04,59.04
PB1: length 5.7
  Top Layer w0.254: 66.69,56.48 66.66,56.5 61.04,56.5
PB8: length 117.5
  Top Layer w0.254: U6.16 82.98,78.24 82.98,36.39 81.03,34.43 46.99,34.43 OLED1.3
  Bottom Layer w0.254: U6.16 87.37,79.32 U14.16
  Bottom Layer w0.381: OLED2.3 54.74,24.02 46.23,32.53 43.94,32.53 43.05,31.64 OLED1.3
PB9: length 114.4
  Top Layer w0.254: OLED1.4 49.02,33.92 81.15,33.92 83.44,36.21 83.44,80.33 U6.17
  Bottom Layer w0.254: U14.17 87.37,81.86 U6.17
  Bottom Layer w0.381: OLED2.4 54.61,21.48 OLED1.4
PC13: length 44.3
  Top Layer w0.254: 61.04,86.98 66.66,86.98 66.69,86.96
  Bottom Layer w0.254: U15.19 57.28,83.23 57.28,52.59 55.37,50.69
PC14: length 44.3
  Top Layer w0.254: 66.69,84.42 66.66,84.44 61.04,84.44
  Bottom Layer w0.254: 55.37,48.15 57.79,50.56 57.79,81.19 U15.18
PC15: length 44.5
  Top Layer w0.254: 61.04,81.9 66.66,81.9 66.69,81.88
  Bottom Layer w0.254: U15.17 60.66,81.89 58.29,79.52 58.29,48.53 55.37,45.61
PWM_ESP32: length 2.9
  Top Layer w0.254: H6.3 H7.3
REST_YJ: length 13.9
  Top Layer w0.254: U6.37 66.64,48.87 U15.4 58.97,48.87 U12.15
$1N4351: length 5.2
  Top Layer w0.381: C4.2 46.78,42.22 D20.1 47.5,39.9 48.08,40.47 U7.3
$1N5150: length 5.5
  Bottom Layer w0.254: U14.1 87.37,41.22 U6.1
$1N5156: length 5.5
  Bottom Layer w0.254: U14.2 87.37,43.76 U6.2
$1N5158: length 5.5
  Bottom Layer w0.254: U6.3 81.93,46.33 U14.3
$1N5160: length 5.5
  Bottom Layer w0.254: U6.4 87.37,48.84 U14.4
$1N5210: length 5.5
  Bottom Layer w0.254: U6.11 81.93,66.65 U14.11
$1N5216: length 5.5
  Bottom Layer w0.254: U14.10 87.37,64.08 U6.10
$1N5238: length 5.7
  Top Layer w0.254: U6.21 66.64,89.51 U15.20
$1N12997: length 2.1
  Top Layer w0.508: 15.49,42.81 15.58,42.9 R1.1
$1N12999: length 2.1
  Top Layer w0.508: U17.2 18.16,42.9 R2.1
$1N13001: length 2.1
  Top Layer w0.508: R3.1 12.99,42.9 U18.2

## Copper pours and planes (outline as drawn; the poured copper is in the pictures)
GND on Top Layer: -1.65,96.28 101.73,96.28 101.73,15.51 -1.65,15.51
GND on Bottom Layer: -1.65,96.15 101.73,96.15 101.73,15.51 -1.65,15.51

Small or netless copper shapes (teardrops, artwork), in the pictures only: 75 on Top Layer, 45 on Bottom Layer

## Text on the board
Bottom Silkscreen Layer: VCC | GND
Top Silkscreen Layer: +5V | +3.3V | GND | 5V | PWM | MPU6050调试端口 | RX | TX | +12V | OFF | ON | COOKIE | 饼干
